# Altium schematic sheet precharge.SchDoc: precharge
size A4; Date: 05.10.2017; CheckedBy: Nico Bieberich; Author: Leon Loeser; Organization: Baltic Racing; Address1: Zur Schwedenschanze 15; Address2: Haus 18; Address3: 18435 Stralsund; Revision: xx.xx; SheetNumber: 6; SheetTotal: 9; Rules: EV5.7; ProjectName: Projekt
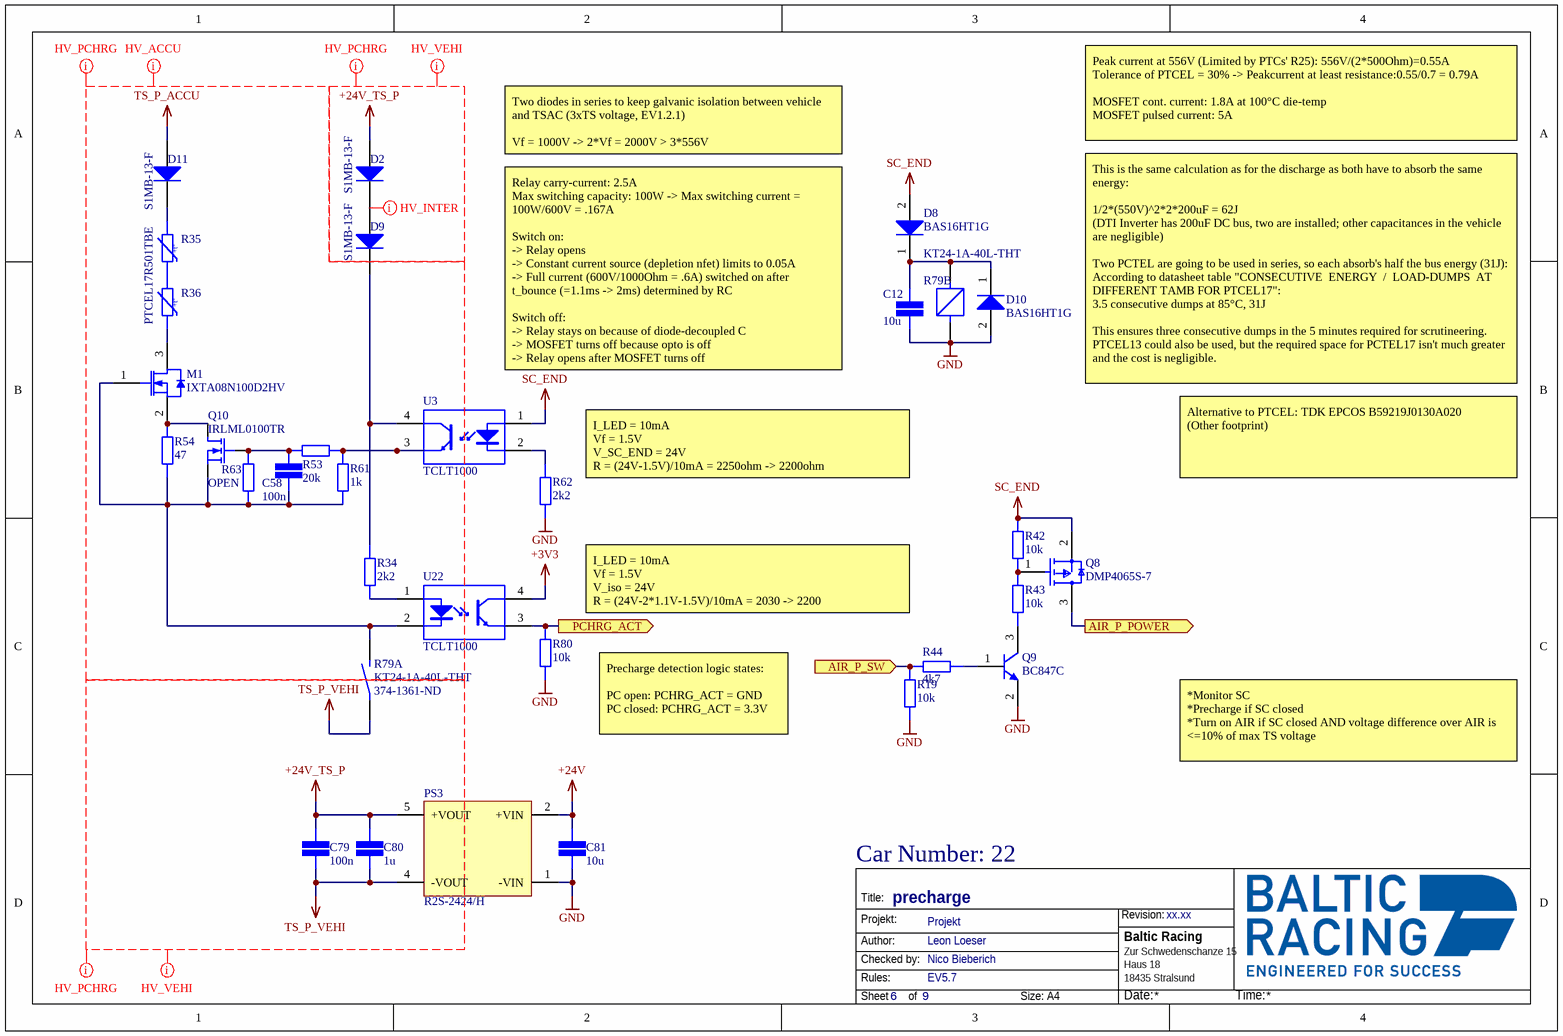
[diagram p0: precharge.SchDoc]

## Parts
C12  value 10u  [CAP 1206/3216]  (hidden comment: SMD Capacitor)
C58  value 100n  [CAP 0603/1608]  (hidden comment: SMD Capacitor)
C79  value 100n  [CAP 0603/1608]  (hidden comment: SMD Capacitor)
C80  value 1u  [CAP 0805/2012]  (hidden comment: SMD Capacitor)
C81  value 10u  [CAP 1206/3216]  (hidden comment: SMD Capacitor)
D2  S1MB-13-F  [DIOD-SMB-2_V]
D8  BAS16HT1G  [ONSC-SOD-323-2-477-02_V]
D9  S1MB-13-F  [DIOD-SMB-2_V]
D10  BAS16HT1G  [ONSC-SOD-323-2-477-02_V]
D11  S1MB-13-F  [DIOD-SMB-2_V]
M1  IXTA08N100D2HV  [IXYS_TO-263HV]
PS3  R2S-2424/H  [RECOM_R2S]
Q8  DMP4065S-7  [FP-SOT23-MFG]
Q9  BC847C  [INF-SOT23_L]
Q10  IRLML0100TR  [SOT23]
R19  value 10k  [STACKPOLE CSR0603]  (hidden comment: SMD Resistor)
R34  value 2k2  [STACKPOLE CSR0603]  (hidden comment: SMD Resistor)
R35  PTCEL17R501TBE  [PTCEL17]
R36  PTCEL17R501TBE  [PTCEL17]  (value not drawn)
R42  value 10k  [STACKPOLE CSR0603]  (hidden comment: SMD Resistor)
R43  value 10k  [STACKPOLE CSR0603]  (hidden comment: SMD Resistor)
R44  value 4k7  [STACKPOLE CSR0603]  (hidden comment: SMD Resistor)
R53  value 20k  [STACKPOLE CSR0603]  (hidden comment: SMD Resistor)
R54  value 47  [STACKPOLE CSR0603]  (hidden comment: SMD Resistor)
R61  value 1k  [STACKPOLE CSR0603]  (hidden comment: SMD Resistor)
R62  value 2k2  [STACKPOLE CSR0603]  (hidden comment: SMD Resistor)
R63  value OPEN  [STACKPOLE CSR0603]  (hidden comment: SMD Resistor)
R79  KT24-1A-40L-THT  Supplier Part Number 1: 374-1361-ND  [STANDEX_KT_THT]  (parts A,B of 2)
R80  value 10k  [STACKPOLE CSR0603]  (hidden comment: SMD Resistor)
U3  TCLT1000  [VISH-SOP4L-4_V]
U22  TCLT1000  [VISH-SOP4L-4_V]

## Ports
AIR_P_POWER (out), AIR_P_SW (in), PCHRG_ACT (out)

## Nets
+3V3: U22.4(C)
+24V: C81.2 PS3.2(+VIN)
+24V_TS_P: C79.1 C80.1 D2.1(A) PS3.5(+VOUT)
GND: C12.1 C81.1 D10.2(A) PS3.1(-VIN) Q9.2(E) R19.2 R62.1 R79.4(L2) R80.1
SC_END: D8.2(A) Q8.2(S) R42.1 U3.1(A)
TS_P_ACCU: D11.1(A)
TS_P_VEHI: C79.2 C80.2 PS3.4(-VOUT) R79.1(COM)
AIR_P_POWER: Q8.3(D) ; port AIR_P_POWER
AIR_P_SW: R19.1 R44.2 ; port AIR_P_SW
PCHRG_ACT: R80.2 U22.3(E) ; port PCHRG_ACT
NetC12_2: C12.2 D8.1(K) D10.1(K) R79.3(L1)
NetC58_1: C58.1 Q10.1(G) R53.2 R63.2
NetC58_2: C58.2 M1.1(GATE) Q10.2(S) R54.1 R61.1 R63.1 R79.2(NO) U22.2(C)
NetD2_2: D2.2(K) D9.1(A)
NetD9_2: D9.2(K) R34.2 U3.4(C)
NetD11_2: D11.2(K) R35.1
NetM1_2: M1.2(SOURCE) Q10.3(D) R54.2
NetM1_3: M1.3(DRAIN) R36.2
NetQ8_1: Q8.1(G) R42.2 R43.1
NetQ9_1: Q9.1(B) R44.1
NetQ9_3: Q9.3(C) R43.2
NetR34_1: R34.1 U22.1(A)
NetR35_2: R35.2 R36.1
NetR53_1: R53.1 R61.2 U3.3(E)
NetR62_2: R62.2 U3.2(C)

## Layout directives
net class HV_PCHRG: +24V_TS_P, TS_P_ACCU, TS_P_VEHI
net class HV_ACCU: TS_P_ACCU
net class HV_VEHI: +24V_TS_P, TS_P_VEHI
net class HV_INTER: NetD2_2

## Notes on the sheet
- Two diodes in series to keep galvanic isolation between vehicle and TSAC (3xTS voltage, EV1.2.1)
  Vf = 1000V -> 2*Vf = 2000V > 3*556V
- Peak current at 556V (Limited by PTCs' R25): 556V/(2*500Ohm)=0.55A
  Tolerance of PTCEL = 30% -> Peakcurrent at least resistance:0.55/0.7 = 0.79A
  MOSFET cont. current: 1.8A at 100°C die-temp
  MOSFET pulsed current: 5A
- Relay carry-current: 2.5A
  Max switching capacity: 100W -> Max switching current = 100W/600V = .167A
  Switch on:
  -> Relay opens
  -> Constant current source (depletion nfet) limits to 0.05A
  -> Full current (600V/1000Ohm = .6A) switched on after t_bounce (=1.1ms -> 2ms) determined by RC
  Switch off:
  -> Relay stays on because of diode-decoupled C
  -> MOSFET turns off because opto is off
  -> Relay opens after MOSFET turns off
  Timing-resistor values based on simulation (in simulation folder)
- This is the same calculation as for the discharge as both have to absorb the same energy:
  1/2*(550V)^2*2*200uF = 62J
  (DTI Inverter has 200uF DC bus, two are installed; other capacitances in the vehicle are negligible)
  Two PCTEL are going to be used in series, so each absorb's half the bus energy (31J):
  According to datasheet table "CONSECUTIVE  ENERGY  /  LOAD-DUMPS  AT DIFFERENT TAMB FOR PTCEL17":
  3.5 consecutive dumps at 85°C, 31J
  This ensures three consecutive dumps in the 5 minutes required for scrutineering. PTCEL13 could also be used, but the required space for PCTEL17 isn't much greater and the cost is negligible.
- (near R62) I_LED = 10mA
  Vf = 1.5V
  V_SC_END = 24V
  R = (24V-1.5V)/10mA = 2250ohm -> 2200ohm
- Alternative to PTCEL: TDK EPCOS B59219J0130A020
  (Other footprint)
- I_LED = 10mA
  Vf = 1.5V
  V_iso = 24V
  R = (24V-2*1.1V-1.5V)/10mA = 2030 -> 2200
- Precharge detection logic states:
  PC open: PCHRG_ACT = GND
  PC closed: PCHRG_ACT = 3.3V
- *Monitor SC
  *Precharge if SC closed
  *Turn on AIR if SC closed AND voltage difference over AIR is <=10% of max TS voltage
- Car Number: 22
- Title:
- Projekt:
- Revision:
- Author:
- Rules:
- Checked by:
- Sheet
- of
- Size:
- A4
- Date:
- Time:
- (in symbol PTCEL17R501TBE) +t°

## Library data of the parts
C12 C81 = SMD Capacitor: Capacitor with multiple Footprints; Voltage: 25V
C58 C79 C80 = SMD Capacitor: Capacitor with multiple Footprints; Voltage: 6.3V
D2 D9 D11 = CMP-2000-07013-1: Surface Mount Glass Passivated Rectifier / , 1 A, 1.1 V, -65 to 150 degC, 2-Pin SMD, RoHS, Tape and Reel; Manufacturer: Diodes Inc; Average Rectified Current-Max: 1A; Forward Voltage: 1.1V; Reverse Current-Max: 5µA; Peak Current-Max: 30A; Reverse Voltage-Max [Vrrm]: 1000V; Manufacturer URL: http://www.diodes.com/; Datasheet URL: http://www.diodes.com/_files/datasheets/ds16003.pdf; Datasheet Version: Rev. 24-2, 12/2014; Package Description: 2-Pin Surface Mount Device, Body 4.315 x 3.62 mm; Package Reference: SMB-2; Mounting Technology: SurfaceMount
D8 D10 = CMP-1054-00068-1: Switching Diode, 2-Pin SOD-323, Pb-Free, Tape and Reel; Manufacturer: On Semiconductor; Configuration: Single; IF Max (A): 0.2; trr Max (ns): 6; Packing: Tape and Reel; ComponentLink2URL: http://www.onsemi.com/pub_link/Collateral/BAS16HT1-D.PDF; ComponentLink3Description: Package Specification; RoHS: TRUE; PackageDescription: 2-Pin SOD, Body 1.7 x 1.25 mm; PackageReference: SOD-323-2-477-02; PartNumber: BAS16HT1G; ComponentLink1URL: http://www.onsemi.com/; Mounting Technology: Surface Mount; ComponentLink1Description: Manufacturer URL; ComponentLink2Description: Datasheet; DatasheetVersion: Rev. 11; PackageVersion: Rev. H, 03/2007; ComponentLink3URL: http://www.onsemi.com/pub_link/Collateral/477-02.PDF.1
M1 = IXTA08N100D2HV: D2 Series - 100V - 1700V N-Channel Depletion Mode Power MOSFETs, TO-263HV, RoHS; Manufacturer: Littelfuse; Supplier 1: Arrow Electronics; Manufacturer Part Number: IXTA08N100D2HV; RoHS: Yes; Category: MOSFETs; Stock 1: 30; Pricing 1: 1=1,74230, 300=2,14500, 500=1,90100, 1000=1,67700, 2000=1,66000, 2500=1,64400, 3000=1,62700, 4000=1,61100, 5000=1,59500, 10000=1,57900, 20000=1,56300 (USD); Supplier Part Number 1: IXTA08N100D2HV
PS3 = R2S-2424/H: 2W DC/DC-Converter 'ECONOLINE' SMD 3kV unreg; V. In: 24; V. Out: 24; mA. Out: 83; Manufacturer: Recom; Number of Outputs: 1; Efficiency: 85%; Min Input Voltage: 21.6V; Max Input Voltage: 26.4V; Voltage - Output 1: 24V; Max Output Current: 83mA; Isolation: Isolated; Supplier 1: Digi-Key; Manufacturer Part Number: R2S-2424/H; RoHS: Yes; Category: Voltage Regulators - Switching; Stock 1: 519; Pricing 1: 1=15,71000, 5=15,59400, 10=15,47600, 25=15,23760, 50=14,76140, 100=13,33290, 250=13,09480, 440=12,85673 (USD); Mount: Surface Mount; Case/Package: SMD/SMT; Number of Pins: 5; Weight: 1.4g; Min Operating Temperature: -40°C; Max Operating Temperature: 100°C; Packaging: Rail/Tube; Output Power: 2W; Package Quantity: 39; Isolation Voltage: 3kV; Nominal Input Voltage: 24V; Max Power Dissipation: 2W; Max Output Voltage: 24V; Features: SCP; Series: ECONOLINE R2S; Output Voltage: 24V; Output Current: 83mA; Length: 12.75mm; Width: 10.7mm; Height: 8.7mm; Depth: 10.7mm; RoHS Compliant: Yes; Lead Free: Lead Free; ComponentLink1URL: https://datasheet.ciiva.com/6225/r2s-r2d-6225029.pdf?src-supplier=Digi-Key; ComponentLink1Description: Datasheet; Supplier Part Number 1: 945-1769-5-ND
Q8 = CMP-12801-000050-1: MOSFET P-CH 40V 2.4A SOT23; Manufacturer: Diodes Inc.; Number Of Channels: 1; Max Junction Temp: +150°C; Standoff Height: 0.013mm; Power Dissipation: 0.72W; Turn Off Delay Time: 36.3ns; Rthja Max: 171°C/W; Typ Forward Diode Voltage: -0.7V; Max Forward Diode Voltage: -1.2V; Drain To Source Voltage: -40V; Threshold Vgs Min: -1V; Gate To Source Voltage: 20V; Depletion Mode: False; Input Capacitace At Vds: 587pF @ -20V; Drain To Source Resistance: 64mΩ; Turn On Delay Time: 3.6ns; Continuous Drain Current: -2.4A; Pulse Drain Current: -20A; Gate Charge At Vgs: 12.2nC @ -10V; Threshold Vgs Max: -3V; Octopart: https://octopart.com/dmp4065s-7-diodes+inc.-57605044; Footprint Url: https://www.diodes.com/assets/Package-Files/SOT23.pdf; Device Class L2: Transistors; Package: SOT23; Number Of P Channels: 1; ComponentLink2URL: https://www.diodes.com/assets/Datasheets/DMP4065S.pdf; Temperature Range High: +150°C; Device Class L1: Discrete Semiconductors; Temperature Range Low: -55°C; Manufacturer Part Number: DMP4065S-7; ComponentLink2Description: Datasheet; Lead Free: Yes; Temperature: -55°C to +150°C; Drain To Source Breakdown Voltage: -40V; Category: Trans; Height: 1.1mm; Digikey Description: MOSFET P-CH 40V 2.4A SOT23; Ipc Land Pattern Name: SOT92P240X102-3; Device Class L3: MOSFETs; RoHS: TRUE; Mouser Description: Trans MOSFET P-CH 40V 2.4A Automotive 3-Pin SOT-23 T/R; Automotive: No
Q9 = CMP-1177-00037-1: NPN Silicon AF Transistor, 45 V VCEO, 100 mA IC, SOT23, Reel, Green; Manufacturer: Infineon; VCEO (max): 45Â V; VEBO (max): 6Â V; fT (typ): 250Â MHz; VCBO (max): 50Â V; ICM (max): 200Â mA; Green: TRUE; IC (max): 100Â mA; Ptot (max): 330Â mW; ICBO (max): 15Â nA; PartNumber: BC847C; ComponentLink3URL: http://www.infineon.com/dgdl/SOT23-Package_Overview.pdf?folderId=db3a30431936bc4b0119532290053c66&fileId=db3a30431936bc4b0119533468123c85; ComponentLink3Description: Package Specification; Mounting Technology: Surface Mount; PackageDescription: 3-Pin Small Outline Transistor Package, 1.3 x 2.9 mm Body, 0.95 mm Pitch; PackageReference: SOT23; ComponentLink2URL: http://www.infineon.com/dgdl/bc847series_bc848series_bc849series_bc850series.pdf?folderId=db3a304314dca389011541d30fa21656&fileId=db3a304314dca389011541d4630a1657; ComponentLink2Description: Datasheet; ComponentLink1Description: Manufacturer URL; Polarity: NPN; ComponentLink1URL: http://www.infineon.com/; IBM (max): 200Â mA; Packing: Reel; PackageVersion: Apr-08
Q10 = MOSFET N: N-Channel MOSFET / RK7002BMT116: / 250mA, 60Vds, 20Vgs / IRLML0100TR: / 1.6A, 100Vds, 16Vgs
R19 R34 R42-R44 R53 R54 R61-R63 R80 = SMD Resistor: Resistor with multiple footprints
R35 R36 = PTCEL17R501TBE: PTCEL Series 1000 V 500 Ohm ±30 % Radial Inrush Current Limiter PTC Thermistor; Manufacturer: Vishay BCcomponents; Tolerance: 30%; Supplier 1: Mouser; Manufacturer Part Number: PTCEL17R501TBE; RoHS: No; Stock 1: 130; Pricing 1: 1=3,37000, 5=3,30000, 10=3,15000, 25=3,00000, 50=2,70000, 100=2,55000, 200=2,46000, 500=2,25000, 1000=2,17000, 10000=2,17000 (USD); RoHS Compliant: No; ComponentLink1URL: http://www.vishay.com/docs/29165/ptcel.pdf?src-supplier=Digi-Key; ComponentLink1Description: http://www.vishay.com/docs/29165/ptcel.pdf?src-supplier=Digi-Key; Supplier Part Number 1: 594-PTCEL17R501TBE
R79 = STANDEX_KT24-1A-40L-THT: Reed Relay, Kt Series, 24 Vdc, 1.8 Kohm, 1 A, 1 Kv, Spst-No Rohs Compliant: Yes; Manufacturer: Standex-Meder Electronics; Coil Current: 13.3mA; Throw Configuration: SPST; Coil Power: 320mW; Coil Resistance: 1.8kR; Coil Type: Non-Latching; Coil Voltage (DC): 24V; Contact Current Rating: 1A; Supplier 1: Digi-Key; Manufacturer Part Number: KT24-1A-40L-THT; RoHS: No; Category: Uncategorized; Pricing 1: 1=11,88000, 15=11,13533, 30=9,89800, 45=9,40311, 90=8,90822, 240=7,91842, 450=7,42351, 945=6,92860 (USD); Mount: Through Hole; Min Operating Temperature: -40°C; Max Operating Temperature: 100°C; Package Quantity: 15; Packaging: Rail/Tube; Termination: PC Pin; Relay Type: Reed; REACH SVHC: Unknown; RoHS Compliant: No; ComponentLink1URL: https://standexelectronics.com/de/ressourcen/technische-bibliothek/technische-informationen/datasheet-kt-series-reed-relay/; ComponentLink1Description: Datasheet
U3 U22 = CMP-2000-07234-1: Optocoupler, Phototransistor Output, VCEO 70 V, -55 to 100 degC, 4-Pin SOP (SOP4L), RoHS, Tape and Reel; Manufacturer: Vishay/Semiconductor; Maximum Collector Emitter Voltage: 70V; Input Type: DC; Maximum Reverse Voltage: 6V; Maximum Collector Emitter Saturation Voltage: 300mV; Number of Channels per Chip: 1; Maximum Collector Current: 50mA; Maximum Power Dissipation: 250mW; Maximum Forward Voltage: 1.6V; Maximum Input Current: 60mA; Typical Forward Voltage: 1.25V; Minimum Isolation Voltage: 5000Vrms; Maximum Current Transfer Ratio @ Current: 600%; Manufacturer URL: http://www.vishay.com/; Package: 4SOP; Mounting Technology: SurfaceMount; Category: TransistorandPhotovoltaicOutputPhotoCouplers; Datasheet URL: http://www.vishay.com/docs/83515/tclt1000.pdf; Output Type: DC; Operating Temperature: -40to100°C; Package Description: 4-Pin Small Outline Package Integrated Circuit, Body 4.1 x 7.5 mm, Pitch 2.54 mm; Datasheet Version: Rev. 2.9, 12/2015; Package Reference: SOP4L; Packaging: Tape&Reel